# EasyEDA schematic LQFP48_TO_DIP.json
TITLE: Sheet_1; REV: 1.0; Date: 2025-05-25; Sheet: 1/1; Drawn By: spamundwerbung3; Company: Your Company
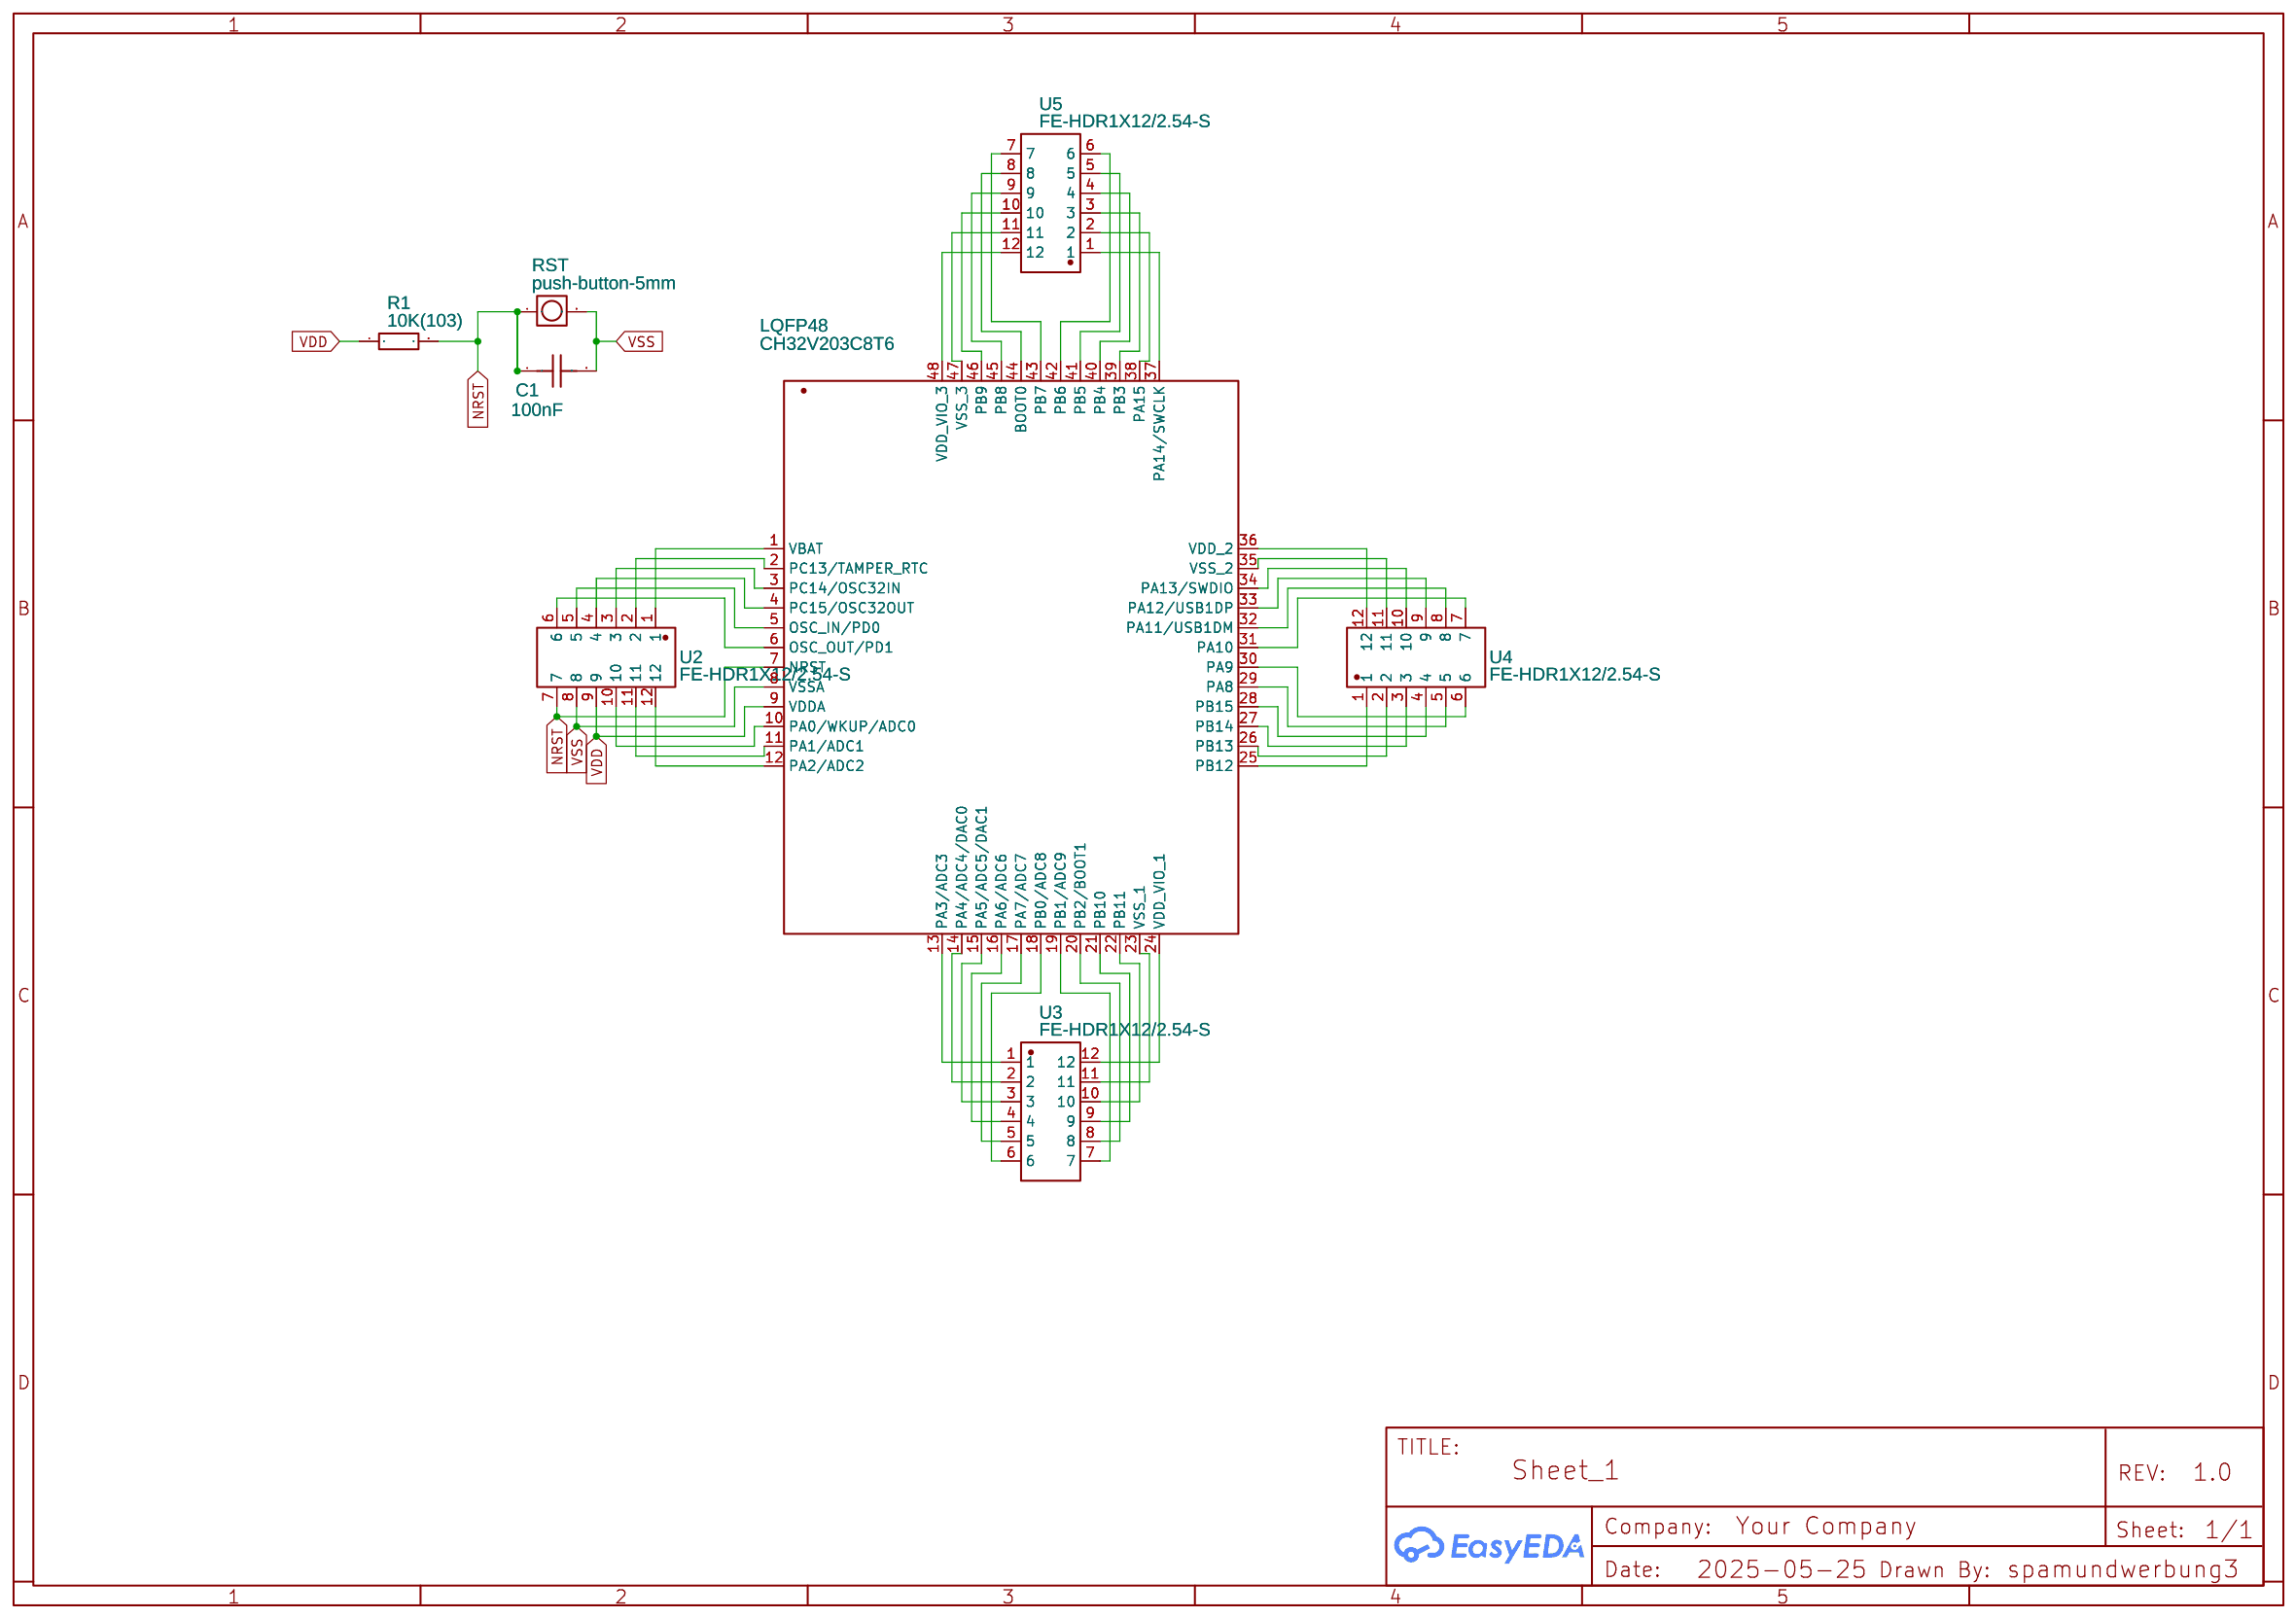
[diagram p0: schematic sheet]

## Parts
C1  100nF  [C0603]
LQFP48  CH32V203C8T6  [LQFP-48_L7.0-W7.0-P0.50-LS9.0-BL]
R1  10K(103)  [0603]
RST  push-button-5mm  [PUSH-BUTTON-5MM]
U2  FE-HDR1X12/2.54-S  [HDR-TH_12P-P2.54_FE-HDR1X12-2.54-S]
U3  FE-HDR1X12/2.54-S  [HDR-TH_12P-P2.54_FE-HDR1X12-2.54-S]
U4  FE-HDR1X12/2.54-S  [HDR-TH_12P-P2.54_FE-HDR1X12-2.54-S]
U5  FE-HDR1X12/2.54-S  [HDR-TH_12P-P2.54_FE-HDR1X12-2.54-S]

## Library data of the parts
C1 = C100NF_0603: Contributor: LCSC; Supplier: LCSC; Supplier Part: C478888; Manufacturer: TORCH(火炬); Manufacturer Part: C0603B104K500NT; JLCPCB Part Class: Extended Part
LQFP48 = CH32V203C8T6: Contributor: lcsc; Supplier: LCSC; Supplier Part: C3001172; Manufacturer: WCH(南京沁恒); JLCPCB Part Class: Extended Part
R1 = 0603 10K RESISTOR (SMD): Supplier Part: C99198; Supplier: LCSC; Manufacturer: YAGEO; Manufacturer Part: RC0603JR-0710KL
RST = push-button-5mm: Contributor: javierglezmartin
U2-U5 = FE-HDR1X12/2.54-S: Contributor: lcsc; Supplier: LCSC; Supplier Part: C9900013702; Manufacturer: null; Manufacturer Part: Fe-HDR1X12/2.54-S; JLCPCB Part Class: Extended Part

## Nets
VDD: LQFP48.9(VDDA) R1.1 U2.9
VSS: C1.2 LQFP48.8(VSSA) RST.2 U2.8
NRST: C1.1 LQFP48.7(NRST) R1.2 RST.1 U2.7
Net-(LQFP48-1): LQFP48.1(VBAT) U2.1
Net-(LQFP48-2): LQFP48.2(PC13/TAMPER_RTC) U2.2
Net-(LQFP48-3): LQFP48.3(PC14/OSC32IN) U2.3
Net-(LQFP48-4): LQFP48.4(PC15/OSC32OUT) U2.4
Net-(LQFP48-5): LQFP48.5(OSC_IN/PD0) U2.5
Net-(LQFP48-6): LQFP48.6(OSC_OUT/PD1) U2.6
Net-(LQFP48-10): LQFP48.10(PA0/WKUP/ADC0) U2.10
Net-(LQFP48-11): LQFP48.11(PA1/ADC1) U2.11
Net-(LQFP48-12): LQFP48.12(PA2/ADC2) U2.12
Net-(LQFP48-13): LQFP48.13(PA3/ADC3) U3.1
Net-(LQFP48-14): LQFP48.14(PA4/ADC4/DAC0) U3.2
Net-(LQFP48-15): LQFP48.15(PA5/ADC5/DAC1) U3.3
Net-(LQFP48-16): LQFP48.16(PA6/ADC6) U3.4
Net-(LQFP48-17): LQFP48.17(PA7/ADC7) U3.5
Net-(LQFP48-18): LQFP48.18(PB0/ADC8) U3.6
Net-(LQFP48-19): LQFP48.19(PB1/ADC9) U3.7
Net-(LQFP48-20): LQFP48.20(PB2/BOOT1) U3.8
Net-(LQFP48-21): LQFP48.21(PB10) U3.9
Net-(LQFP48-22): LQFP48.22(PB11) U3.10
Net-(LQFP48-23): LQFP48.23(VSS_1) U3.11
Net-(LQFP48-24): LQFP48.24(VDD_VIO_1) U3.12
Net-(LQFP48-25): LQFP48.25(PB12) U4.1
Net-(LQFP48-26): LQFP48.26(PB13) U4.2
Net-(LQFP48-27): LQFP48.27(PB14) U4.3
Net-(LQFP48-28): LQFP48.28(PB15) U4.4
Net-(LQFP48-29): LQFP48.29(PA8) U4.5
Net-(LQFP48-30): LQFP48.30(PA9) U4.6
Net-(LQFP48-31): LQFP48.31(PA10) U4.7
Net-(LQFP48-32): LQFP48.32(PA11/USB1DM) U4.8
Net-(LQFP48-33): LQFP48.33(PA12/USB1DP) U4.9
Net-(LQFP48-34): LQFP48.34(PA13/SWDIO) U4.10
Net-(LQFP48-35): LQFP48.35(VSS_2) U4.11
Net-(LQFP48-36): LQFP48.36(VDD_2) U4.12
Net-(LQFP48-37): LQFP48.37(PA14/SWCLK) U5.1
Net-(LQFP48-38): LQFP48.38(PA15) U5.2
Net-(LQFP48-39): LQFP48.39(PB3) U5.3
Net-(LQFP48-40): LQFP48.40(PB4) U5.4
Net-(LQFP48-41): LQFP48.41(PB5) U5.5
Net-(LQFP48-42): LQFP48.42(PB6) U5.6
Net-(LQFP48-43): LQFP48.43(PB7) U5.7
Net-(LQFP48-44): LQFP48.44(BOOT0) U5.8
Net-(LQFP48-45): LQFP48.45(PB8) U5.9
Net-(LQFP48-46): LQFP48.46(PB9) U5.10
Net-(LQFP48-47): LQFP48.47(VSS_3) U5.11
Net-(LQFP48-48): LQFP48.48(VDD_VIO_3) U5.12
